# EAGLE schematic VoltageLevelMeter1 (EAGLE 9.2.2)
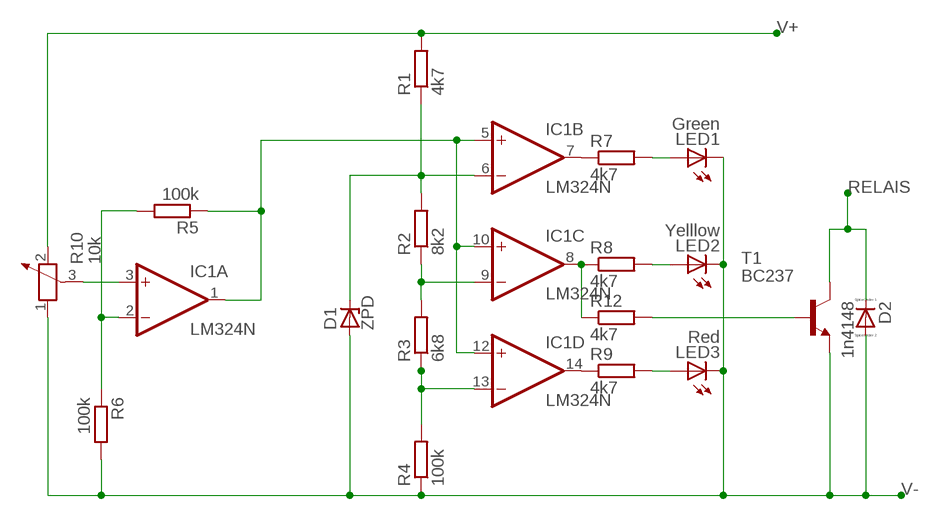
[diagram p0: schematic, sheet 1]

## Parts
D1  ZPD  [DO35Z10]
D2  1n4148  DIODE_E-DO35-7  [DIODE_DO35-7]
IC1  LM324N  [DIL14]
LED1  Green  LED3MM  [LED3MM]
LED2  Yelllow  LED3MM  [LED3MM]
LED3  Red  LED3MM  [LED3MM]
R1  4k7  R-EU_0207/7  [0207/7]
R2  8k2  R-EU_0207/7  [0207/7]
R3  6k8  R-EU_0207/7  [0207/7]
R4  100k  R-EU_0207/7  [0207/7]
R5  100k  R-EU_0207/7  [0207/7]
R6  100k  R-EU_0207/7  [0207/7]
R7  4k7  R-EU_0207/7  [0207/7]
R8  4k7  R-EU_0207/7  [0207/7]
R9  4k7  R-EU_0207/7  [0207/7]
R10  10k  POTENTIOMETER_PT-10  [PT-10]
R12  4k7  R-EU_0207/7  [0207/7]
T1  BC237  [TO92]

## Nets
N$1: D1.C IC1.6(B:-IN) R1.1 R2.2
N$2: IC1.9(C:-IN) R2.1 R3.2
N$3: IC1.13(D:-IN) R3.1 R4.2
N$4: IC1.14(D:OUT) R9.1
N$5: IC1.8(C:OUT) R8.1 R12.1
N$6: IC1.7(B:OUT) R7.1
N$7: IC1.1(A:OUT) IC1.5(B:+IN) IC1.10(C:+IN) IC1.12(D:+IN) R5.1
N$8: IC1.2(A:-IN) R5.2 R6.1
N$9: R12.2 T1.2(B)
N$10: LED1.A R7.2
N$11: LED2.A R8.2
N$12: LED3.A R9.2
N$14: IC1.3(A:+IN) R10.3
RELAIS: D2.C(A) T1.3(C)
V+: R1.2 R10.2
V-: D1.A D2.A(C) LED1.K(C) LED2.K(C) LED3.K(C) R4.1 R6.2 R10.1 T1.1(E)

## Power pins joined to a net without a drawn wire
V+: IC1.4(P:V+)
V-: IC1.11(P:V-)

## Library data of the parts
D1 = diode:ZPD: Z DIODE 500 mW
D2 = eagle-ltspice:DIODE_E-: Schottky Diode; SPICEMODEL: diode; SPICEPREFIX: D
IC1 = linear:LM324: OP AMP
LED1-LED3 = led:LED: LED OSRAM: - CHIPLED LG R971, LG N971, LY N971, LG Q971, LY Q971, LO R971, LY R971 LH N974, LH R974 LS Q976, LO Q976, LY Q976 LO Q996 - Hyper CHIPLED LW Q18S LB Q993, LB Q99A, LB R99A - SideLED LS A670, LO A670, LY A670, LG A670, LP A670 LB A673, LV A673, LT A673, LW A673 LH A674 LY A675 LS A676, LA A676, LO A676, LY A676, LW A676 LS A679, LY A679, LG A679 - Hyper Micro SIDELED® LS Y876, LA Y876, LO Y876, LY Y876 LT Y87S - SmartLED LW L88C, LW L88S LB L89C, LB L89S, LG L890 LS L89K, LO L89K, LY L89K LS L896, LA L896, LO L896, LY L896 - TOPLED LS T670, LO T670, LY T670, LG T670, LP T670 LSG T670, LSP T670, LSY T670, LOP T670, LYG T670 LG T671, LOG T671, LSG T671 LB T673, LV T673, LT T673, LW T673 LH T674 LS T676, LA T676, LO T676, LY T676, LB T676, LH T676, LSB T676, LW T676 LB T67C, LV T67C, LT T67C, LS T67K, LO T67K, LY T67K, LW E67C LS E67B, LA E67B, LO E67B, LY E67B, LB E67C, LV E67C, LT E67C LW T67C LS T679, LY T679, LG T679 LS T770, LO T770, LY T770, LG T770, LP T770 LB T773, LV T773, LT T773, LW T773 LH T774 LS E675, LA E675, LY E675, LS T675 LS T776, LA T776, LO T776, LY T776, LB T776 LHGB T686 LT T68C, LB T68C - Hyper Mini TOPLED® LB M676 - Mini TOPLED Santana® LG M470 LS M47K, LO M47K, LY M47K Source: http://www.osram.convergy.de LUXEON: - LUMILED® LXK2-PW12-R00, LXK2-PW12-S00, LXK2-PW14-U00, LXK2-PW14-V00 LXK2-PM12-R00, LXK2-PM12-S00, LXK2-PM14-U00 LXK2-PE12-Q00, LXK2-PE12-R00, LXK2-PE12-S00, LXK2-PE14-T00, LXK2-PE14-U00 LXK2-PB12-K00, LXK2-PB12-L00, LXK2-PB12-M00, LXK2-PB14-N00, LXK2-PB14-P00, LXK2-PB14-Q00 LXK2-PR12-L00, LXK2-PR12-M00, LXK2-PR14-Q00, LXK2-PR14-R00 LXK2-PD12-Q00, LXK2-PD12-R00, LXK2-PD12-S00 LXK2-PH12-R00, LXK2-PH12-S00 LXK2-PL12-P00, LXK2-PL12-Q00, LXK2-PL12-R00 Source: www.luxeon.com KINGBRIGHT: KA-3528ASYC Source: www.kingbright.com
R1-R9 R12 = resistor:R-EU_: RESISTOR, European symbol
R10 = rcl:POTENTIOMETER_: Potentiometer
T1 = transistor:BC237: NPN TRANSISTOR

## Net classes
0 default: clearance 0.355 mm